# Altium schematic sheet DS1302.SchDoc
size A0
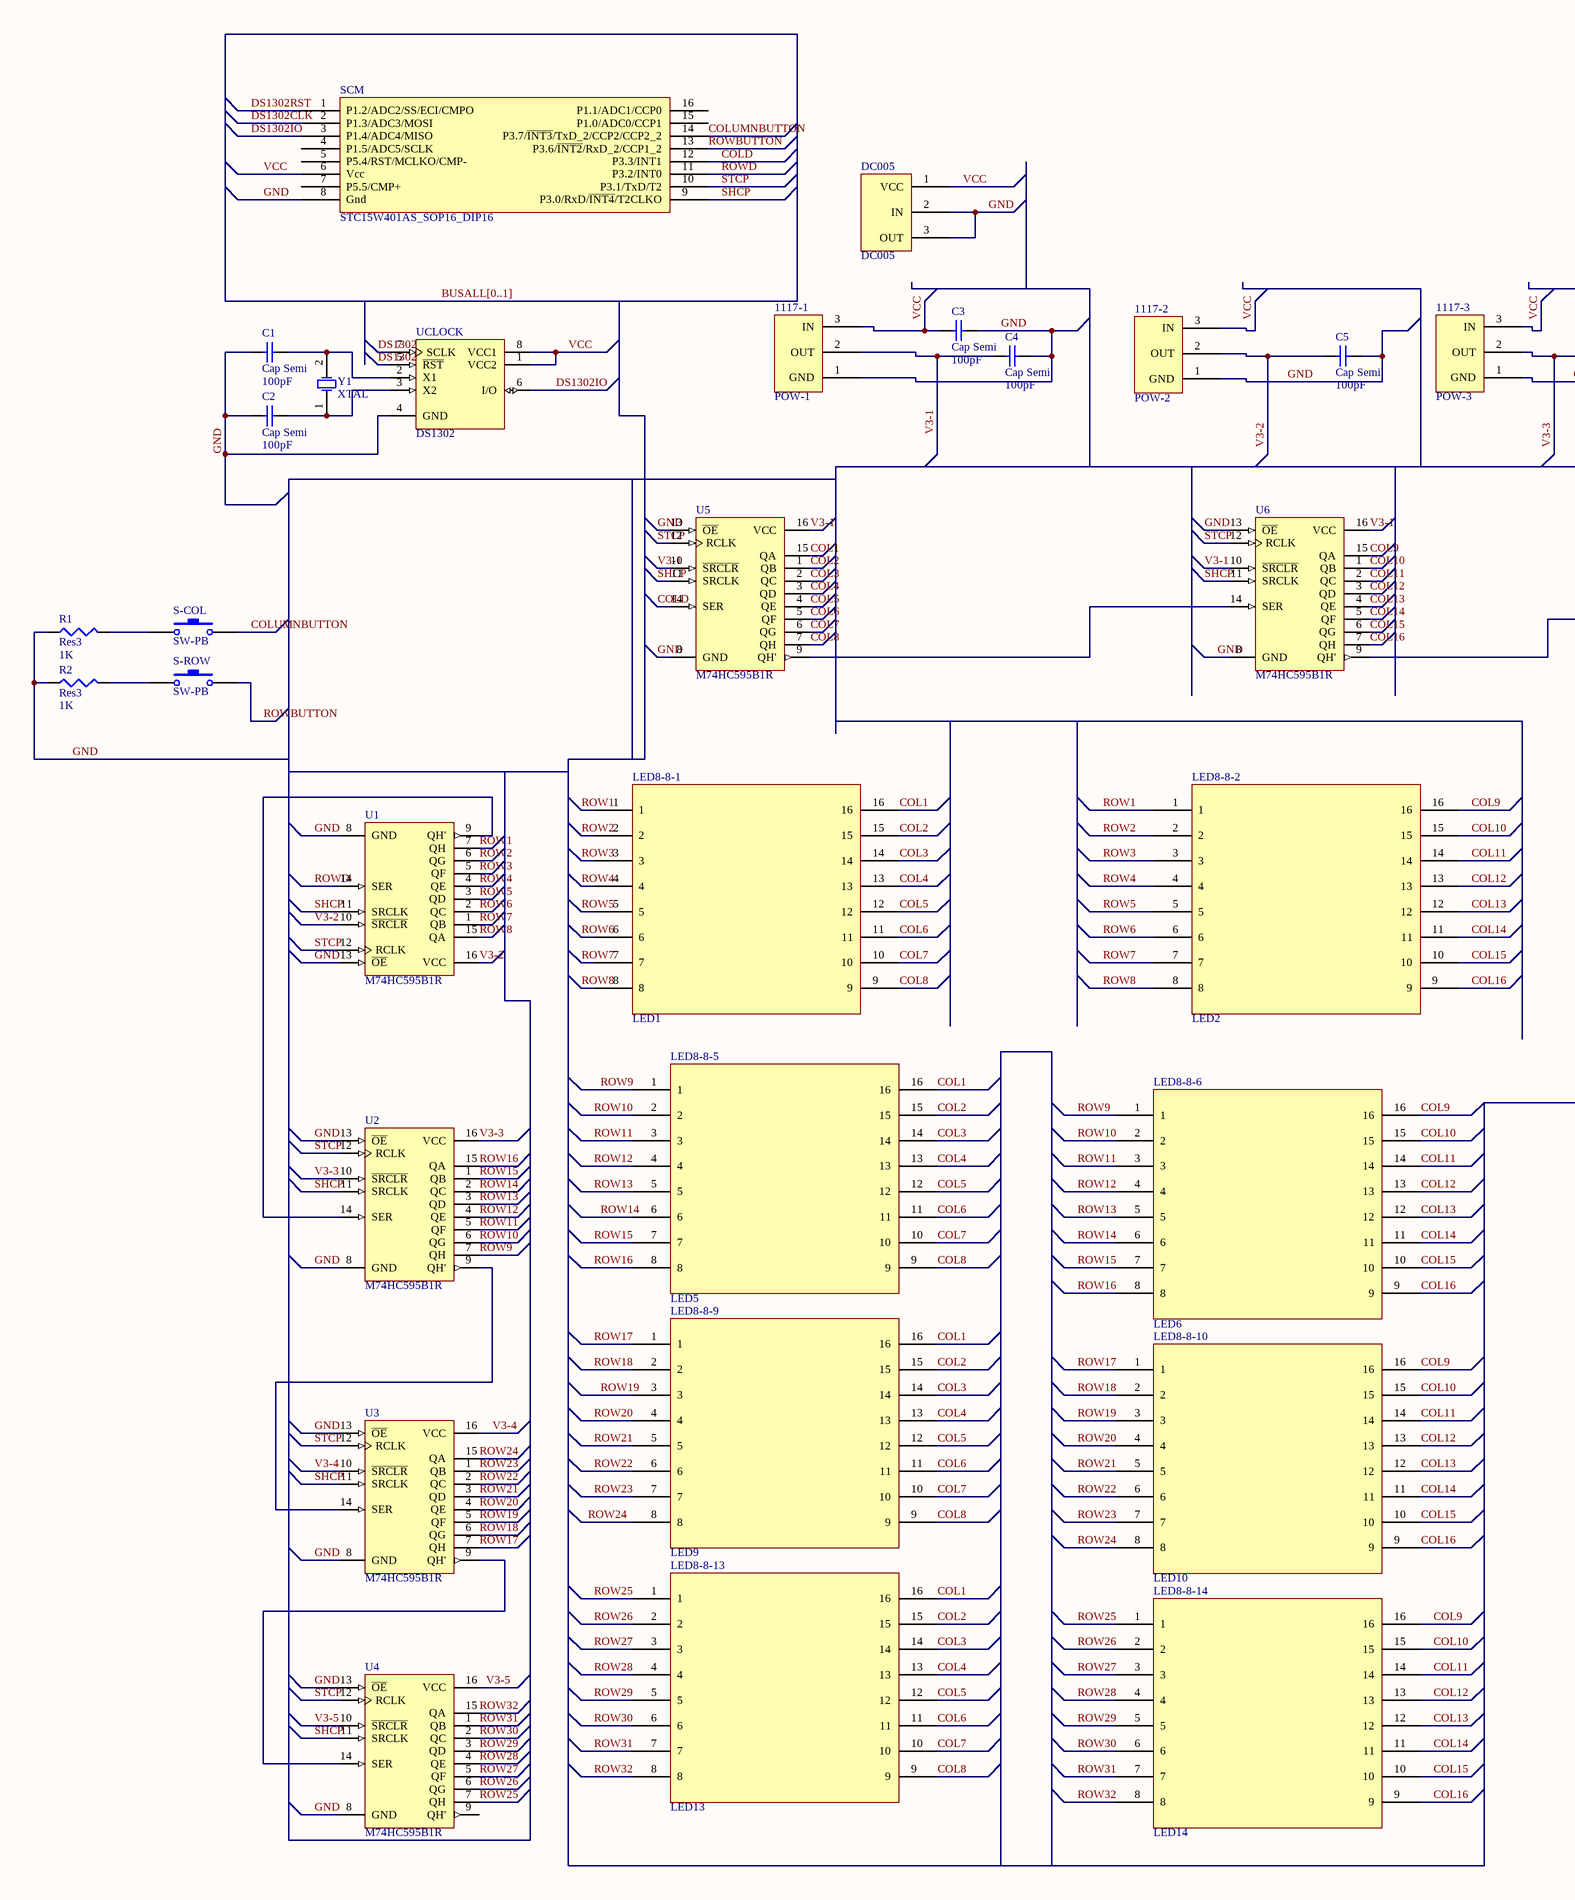
[diagram p0: DS1302.SchDoc, left]
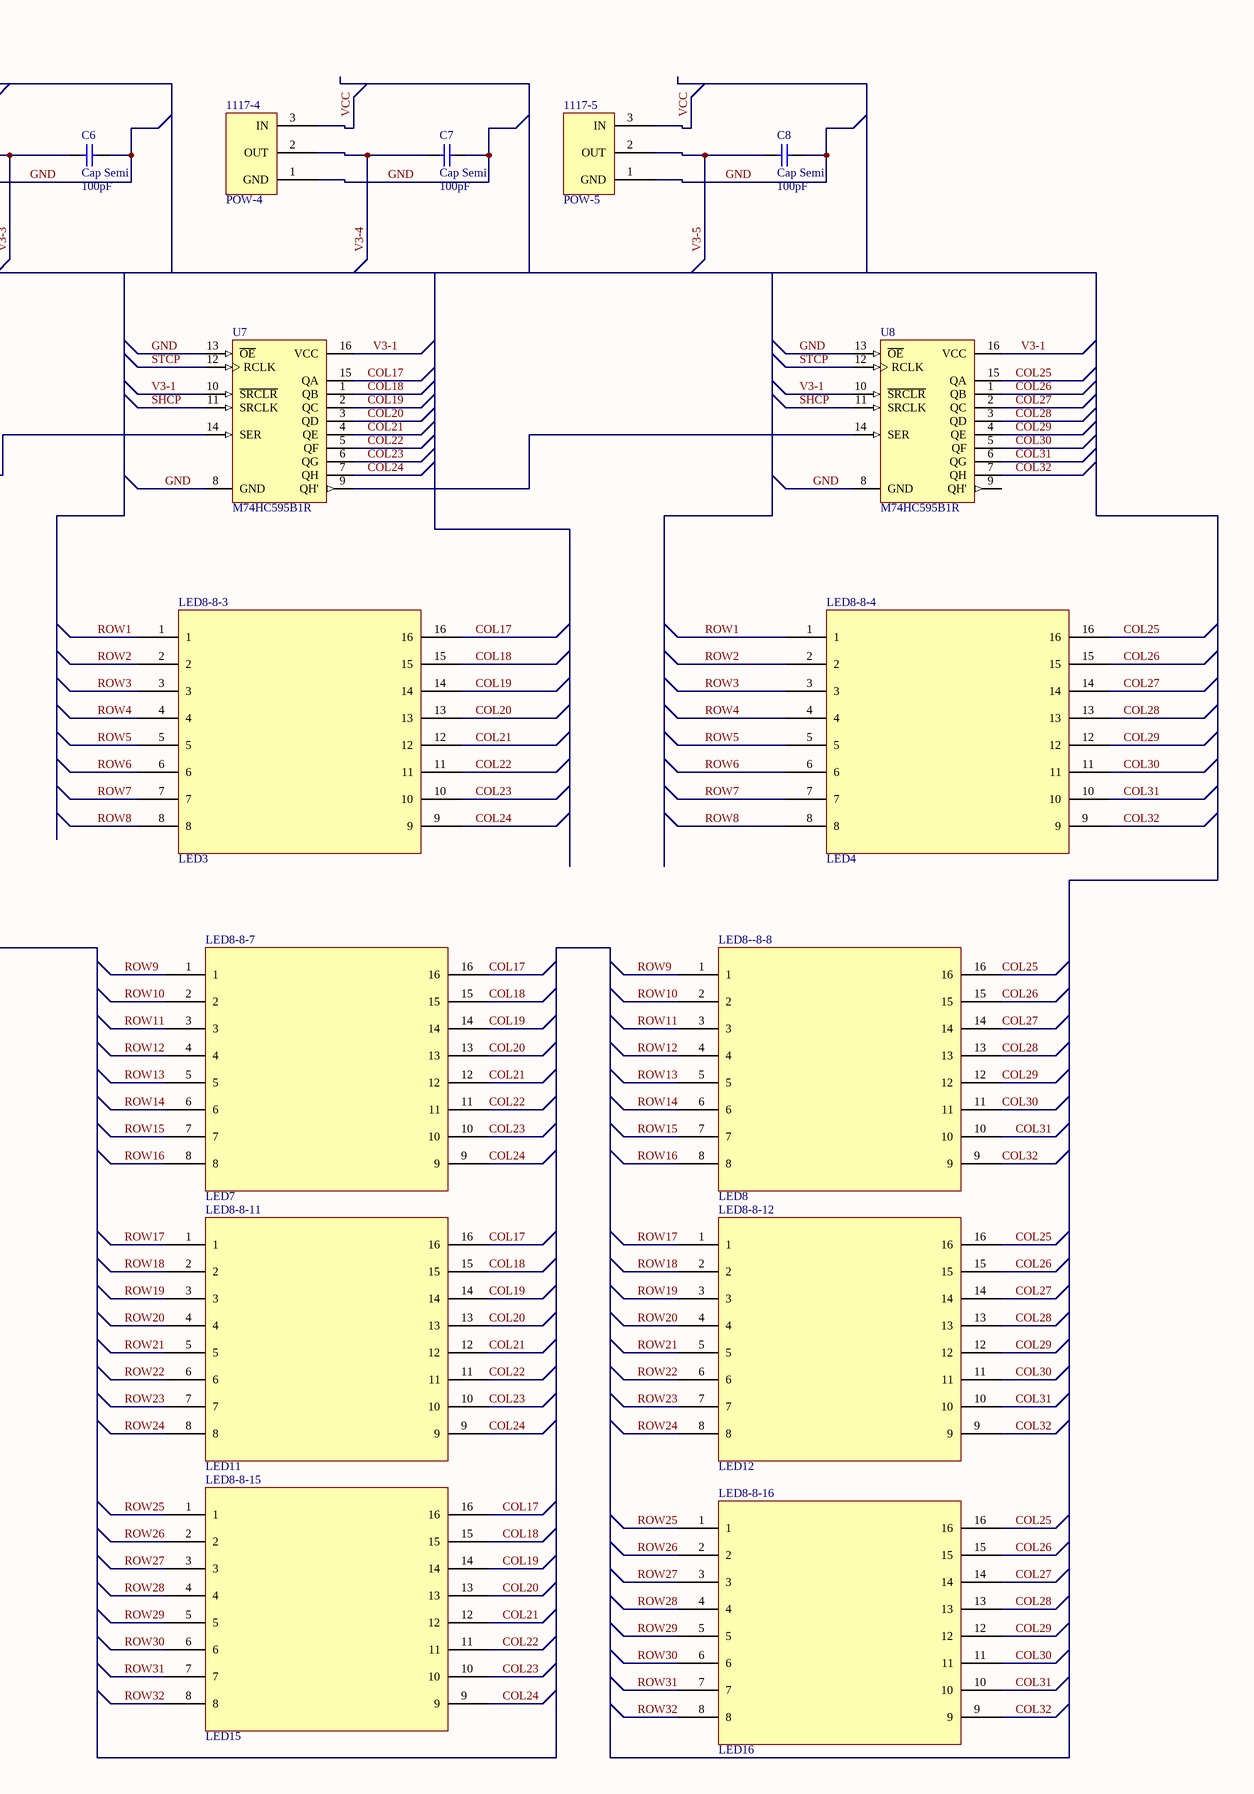
[diagram p1: DS1302.SchDoc, right]

## Parts
1117-1  POW-1  [SOT223-4L]
1117-2  POW-2  [SOT223-4L]
1117-3  POW-3  [SOT223-4L]
1117-4  POW-4  [SOT223-4L]
1117-5  POW-5  [SOT223-4L]
C1  Cap Semi  value 100pF  [2012[0805]]
C2  Cap Semi  value 100pF  [2012[0805]]
C3  Cap Semi  value 100pF  [2012[0805]]
C4  Cap Semi  value 100pF  [2012[0805]]
C5  Cap Semi  value 100pF  [2012[0805]]
C6  Cap Semi  value 100pF  [2012[0805]]
C7  Cap Semi  value 100pF  [2012[0805]]
C8  Cap Semi  value 100pF  [2012[0805]]
DC005  DC005  [DC005]
LED8-8-1  LED1  [LED8-8New]
LED8-8-2  LED2  [LED8-8New]
LED8-8-3  LED3  [LED8-8New]
LED8-8-4  LED4  [LED8-8New]
LED8-8-5  LED5  [LED8-8New]
LED8-8-6  LED6  [LED8-8New]
LED8-8-7  LED7  [LED8-8New]
LED8-8-9  LED9  [LED8-8New]
LED8-8-10  LED10  [LED8-8New]
LED8-8-11  LED11  [LED8-8New]
LED8-8-12  LED12  [LED8-8New]
LED8-8-13  LED13  [LED8-8New]
LED8-8-14  LED14  [LED8-8New]
LED8-8-15  LED15  [LED8-8New]
LED8-8-16  LED16  [LED8-8New]
LED8--8-8  LED8  [LED8-8New]
R1  Res3  value 1K  [2012[0805]]
R2  Res3  value 1K  [2012[0805]]
S-COL  SW-PB  [6332[2512]]
S-ROW  SW-PB  [6332[2512]]
SCM  STC15W401AS_SOP16_DIP16  [DIP-16]
U1  M74HC595B1R  [DIP-16]
U2  M74HC595B1R  [DIP-16]
U3  M74HC595B1R  [DIP-16]
U4  M74HC595B1R  [DIP-16]
U5  M74HC595B1R  [DIP-16]
U6  M74HC595B1R  [DIP-16]
U7  M74HC595B1R  [DIP-16]
U8  M74HC595B1R  [DIP-16]
UCLOCK  DS1302  [DIP8]
Y1  XTAL  [R38]

## Nets
COL1: LED8-8-1.16 LED8-8-5.16 LED8-8-9.16 LED8-8-13.16 U5.15(QA)
COL2: LED8-8-1.15 LED8-8-5.15 LED8-8-9.15 LED8-8-13.15 U5.1(QB)
COL3: LED8-8-1.14 LED8-8-5.14 LED8-8-9.14 LED8-8-13.14 U5.2(QC)
COL4: LED8-8-1.13 LED8-8-5.13 LED8-8-9.13 LED8-8-13.13 U5.3(QD)
COL5: LED8-8-1.12 LED8-8-5.12 LED8-8-9.12 LED8-8-13.12 U5.4(QE)
COL6: LED8-8-1.11 LED8-8-5.11 LED8-8-9.11 LED8-8-13.11 U5.5(QF)
COL7: LED8-8-1.10 LED8-8-5.10 LED8-8-9.10 LED8-8-13.10 U5.6(QG)
COL8: LED8-8-1.9 LED8-8-5.9 LED8-8-9.9 LED8-8-13.9 U5.7(QH)
COL9: LED8-8-2.16 LED8-8-6.16 LED8-8-10.16 LED8-8-14.16 U6.15(QA)
COL10: LED8-8-2.15 LED8-8-6.15 LED8-8-10.15 LED8-8-14.15 U6.1(QB)
COL11: LED8-8-2.14 LED8-8-6.14 LED8-8-10.14 LED8-8-14.14 U6.2(QC)
COL12: LED8-8-2.13 LED8-8-6.13 LED8-8-10.13 LED8-8-14.13 U6.3(QD)
COL13: LED8-8-2.12 LED8-8-6.12 LED8-8-10.12 LED8-8-14.12 U6.4(QE)
COL14: LED8-8-2.11 LED8-8-6.11 LED8-8-10.11 LED8-8-14.11 U6.5(QF)
COL15: LED8-8-2.10 LED8-8-6.10 LED8-8-10.10 LED8-8-14.10 U6.6(QG)
COL16: LED8-8-2.9 LED8-8-6.9 LED8-8-10.9 LED8-8-14.9 U6.7(QH)
COL17: LED8-8-3.16 LED8-8-7.16 LED8-8-11.16 LED8-8-15.16 U7.15(QA)
COL18: LED8-8-3.15 LED8-8-7.15 LED8-8-11.15 LED8-8-15.15 U7.1(QB)
COL19: LED8-8-3.14 LED8-8-7.14 LED8-8-11.14 LED8-8-15.14 U7.2(QC)
COL20: LED8-8-3.13 LED8-8-7.13 LED8-8-11.13 LED8-8-15.13 U7.3(QD)
COL21: LED8-8-3.12 LED8-8-7.12 LED8-8-11.12 LED8-8-15.12 U7.4(QE)
COL22: LED8-8-3.11 LED8-8-7.11 LED8-8-11.11 LED8-8-15.11 U7.5(QF)
COL23: LED8-8-3.10 LED8-8-7.10 LED8-8-11.10 LED8-8-15.10 U7.6(QG)
COL24: LED8-8-3.9 LED8-8-7.9 LED8-8-11.9 LED8-8-15.9 U7.7(QH)
COL25: LED8-8-4.16 LED8-8-12.16 LED8-8-16.16 LED8--8-8.16 U8.15(QA)
COL26: LED8-8-4.15 LED8-8-12.15 LED8-8-16.15 LED8--8-8.15 U8.1(QB)
COL27: LED8-8-4.14 LED8-8-12.14 LED8-8-16.14 LED8--8-8.14 U8.2(QC)
COL28: LED8-8-4.13 LED8-8-12.13 LED8-8-16.13 LED8--8-8.13 U8.3(QD)
COL29: LED8-8-4.12 LED8-8-12.12 LED8-8-16.12 LED8--8-8.12 U8.4(QE)
COL30: LED8-8-4.11 LED8-8-12.11 LED8-8-16.11 LED8--8-8.11 U8.5(QF)
COL31: LED8-8-4.10 LED8-8-12.10 LED8-8-16.10 LED8--8-8.10 U8.6(QG)
COL32: LED8-8-4.9 LED8-8-12.9 LED8-8-16.9 LED8--8-8.9 U8.7(QH)
COLD: SCM.12(P3.3/INT1) U5.14(SER)
COLUMNBUTTON: S-COL.2 SCM.14(P3.7/~{INT3}/TxD_2/CCP2/CCP2_2)
DS1302CLK: SCM.2(P1.3/ADC3/MOSI) UCLOCK.7(SCLK)
DS1302IO: SCM.3(P1.4/ADC4/MISO) UCLOCK.6(I/O)
DS1302RST: SCM.1(P1.2/ADC2/SS/ECI/CMPO) UCLOCK.5(~{RST})
GND: 1117-1.1(GND) 1117-2.1(GND) 1117-3.1(GND) 1117-4.1(GND) 1117-5.1(GND) C1.1 C2.1 C3.2 C4.2 C5.2 C6.2 C7.2 C8.2 DC005.2(IN) DC005.3(OUT) R1.1 R2.1 SCM.8(Gnd) U1.8(GND) U1.13(~{OE}) U2.8(GND) U2.13(~{OE}) U3.8(GND) U3.13(~{OE}) U4.8(GND) U4.13(~{OE}) U5.8(GND) U5.13(~{OE}) U6.8(GND) U6.13(~{OE}) U7.8(GND) U7.13(~{OE}) U8.8(GND) U8.13(~{OE}) UCLOCK.4(GND)
ROW1: LED8-8-1.1 LED8-8-2.1 LED8-8-3.1 LED8-8-4.1 U1.7(QH)
ROW2: LED8-8-1.2 LED8-8-2.2 LED8-8-3.2 LED8-8-4.2 U1.6(QG)
ROW3: LED8-8-1.3 LED8-8-2.3 LED8-8-3.3 LED8-8-4.3 U1.5(QF)
ROW4: LED8-8-1.4 LED8-8-2.4 LED8-8-3.4 LED8-8-4.4 U1.4(QE)
ROW5: LED8-8-1.5 LED8-8-2.5 LED8-8-3.5 LED8-8-4.5 U1.3(QD)
ROW6: LED8-8-1.6 LED8-8-2.6 LED8-8-3.6 LED8-8-4.6 U1.2(QC)
ROW7: LED8-8-1.7 LED8-8-2.7 LED8-8-3.7 LED8-8-4.7 U1.1(QB)
ROW8: LED8-8-1.8 LED8-8-2.8 LED8-8-3.8 LED8-8-4.8 U1.15(QA)
ROW9: LED8-8-5.1 LED8-8-6.1 LED8-8-7.1 LED8--8-8.1 U2.7(QH)
ROW10: LED8-8-5.2 LED8-8-6.2 LED8-8-7.2 LED8--8-8.2 U2.6(QG)
ROW11: LED8-8-5.3 LED8-8-6.3 LED8-8-7.3 LED8--8-8.3 U2.5(QF)
ROW12: LED8-8-5.4 LED8-8-6.4 LED8-8-7.4 LED8--8-8.4 U2.4(QE)
ROW13: LED8-8-5.5 LED8-8-6.5 LED8-8-7.5 LED8--8-8.5 U2.3(QD)
ROW14: LED8-8-5.6 LED8-8-6.6 LED8-8-7.6 LED8--8-8.6 U2.2(QC)
ROW15: LED8-8-5.7 LED8-8-6.7 LED8-8-7.7 LED8--8-8.7 U2.1(QB)
ROW16: LED8-8-5.8 LED8-8-6.8 LED8-8-7.8 LED8--8-8.8 U2.15(QA)
ROW17: LED8-8-9.1 LED8-8-10.1 LED8-8-11.1 LED8-8-12.1 U3.7(QH)
ROW18: LED8-8-9.2 LED8-8-10.2 LED8-8-11.2 LED8-8-12.2 U3.6(QG)
ROW19: LED8-8-9.3 LED8-8-10.3 LED8-8-11.3 LED8-8-12.3 U3.5(QF)
ROW20: LED8-8-9.4 LED8-8-10.4 LED8-8-11.4 LED8-8-12.4 U3.4(QE)
ROW21: LED8-8-9.5 LED8-8-10.5 LED8-8-11.5 LED8-8-12.5 U3.3(QD)
ROW22: LED8-8-9.6 LED8-8-10.6 LED8-8-11.6 LED8-8-12.6 U3.2(QC)
ROW23: LED8-8-9.7 LED8-8-10.7 LED8-8-11.7 LED8-8-12.7 U3.1(QB)
ROW24: LED8-8-9.8 LED8-8-10.8 LED8-8-11.8 LED8-8-12.8 U3.15(QA)
ROW25: LED8-8-13.1 LED8-8-14.1 LED8-8-15.1 LED8-8-16.1 U4.7(QH)
ROW26: LED8-8-13.2 LED8-8-14.2 LED8-8-15.2 LED8-8-16.2 U4.6(QG)
ROW27: LED8-8-13.3 LED8-8-14.3 LED8-8-15.3 LED8-8-16.3 U4.5(QF)
ROW28: LED8-8-13.4 LED8-8-14.4 LED8-8-15.4 LED8-8-16.4 U4.4(QE)
ROW29: LED8-8-13.5 LED8-8-14.5 LED8-8-15.5 LED8-8-16.5 U4.3(QD)
ROW30: LED8-8-13.6 LED8-8-14.6 LED8-8-15.6 LED8-8-16.6 U4.2(QC)
ROW31: LED8-8-13.7 LED8-8-14.7 LED8-8-15.7 LED8-8-16.7 U4.1(QB)
ROW32: LED8-8-13.8 LED8-8-14.8 LED8-8-15.8 LED8-8-16.8 U4.15(QA)
ROWBUTTON: S-ROW.2 SCM.13(P3.6/~{INT2}/RxD_2/CCP1_2)
ROWD: SCM.11(P3.2/INT0) U1.14(SER)
SHCP: SCM.9(P3.0/RxD/~{INT4}/T2CLKO) U1.11(SRCLK) U2.11(SRCLK) U3.11(SRCLK) U4.11(SRCLK) U5.11(SRCLK) U6.11(SRCLK) U7.11(SRCLK) U8.11(SRCLK)
STCP: SCM.10(P3.1/TxD/T2) U1.12(RCLK) U2.12(RCLK) U3.12(RCLK) U4.12(RCLK) U5.12(RCLK) U6.12(RCLK) U7.12(RCLK) U8.12(RCLK)
V3-1: 1117-1.2(OUT) C4.1 U5.10(~{SRCLR}) U5.16(VCC) U6.10(~{SRCLR}) U6.16(VCC) U7.10(~{SRCLR}) U7.16(VCC) U8.10(~{SRCLR}) U8.16(VCC)
V3-2: 1117-2.2(OUT) C5.1 U1.10(~{SRCLR}) U1.16(VCC)
V3-3: 1117-3.2(OUT) C6.1 U2.10(~{SRCLR}) U2.16(VCC)
V3-4: 1117-4.2(OUT) C7.1 U3.10(~{SRCLR}) U3.16(VCC)
V3-5: 1117-5.2(OUT) C8.1 U4.10(~{SRCLR}) U4.16(VCC)
VCC: 1117-1.3(IN) 1117-2.3(IN) 1117-3.3(IN) 1117-4.3(IN) 1117-5.3(IN) C3.1 DC005.1(VCC) SCM.6(Vcc) UCLOCK.1(VCC2) UCLOCK.8(VCC1)
NetC1_2: C1.2 UCLOCK.2(X1) Y1.2(OSC2)
NetC2_2: C2.2 UCLOCK.3(X2) Y1.1(OSC1)
NetR1_2: R1.2 S-COL.1
NetR2_2: R2.2 S-ROW.1
NetU1_9: U1.9(QH') U2.14(SER)
NetU2_9: U2.9(QH') U3.14(SER)
NetU3_9: U3.9(QH') U4.14(SER)
NetU5_9: U5.9(QH') U6.14(SER)
NetU6_9: U6.9(QH') U7.14(SER)
NetU7_9: U7.9(QH') U8.14(SER)

Not connected (* = marked no-connect by the designer): SCM 4(P1.5/ADC5/SCLK) 5(P5.4/RST/MCLKO/CMP-) 7(P5.5/CMP+) 15(P1.0/ADC0/CCP1) 16(P1.1/ADC1/CCP0); U4 9(QH'); U8 9(QH')

## Buses and harness runs
bus BUSALL[0..1]

## Library data of the parts
1117-1-1117-5 = 1117
C1-C8 = Cap Semi: Capacitor (Semiconductor SIM Model); Published: 8-Jun-2000; LatestRevisionDate: 17-Jul-2002; LatestRevisionNote: Re-released for DXP Platform.; PackageReference: C1206; Publisher: Altium Limited
LED8-8-1-LED8-8-7 LED8-8-9-LED8-8-16 LED8--8-8 = LED8-8
R1 R2 = Res3: Resistor; Published: 8-Jun-2000; LatestRevisionDate: 04-Mar-2005; LatestRevisionNote: PCB Footprint replaced.; PackageReference: J1-0603; Publisher: Altium Limited
S-COL S-ROW = SW-PB: Switch; Published: 24-Mar-1999; LatestRevisionDate: 17-Jul-2002; LatestRevisionNote: Re-released for DXP Platform.; PackageReference: SPST-2; Publisher: Altium Limited
U1-U8 = M74HC595B1R: 8 Bit Shift Register with Output Latches (3 STATE); Published: 8-Jun-2000; LatestRevisionDate: 06-Jun-2005; LatestRevisionNote: Stylized 3D Model Added.; DatasheetVersion: Apr-1993; PackageVersion: Apr-1996; PackageReference: DIP16; Publisher: Altium Limited; PackageDescription: DIP; 16 Leads; Row Spacing 7.62 mm; Pitch 2.54 mm; ComponentLink1Description: Manufacturer Link; ComponentLink1URL: http://www.st.com/; ComponentLink2Description: Datasheet; ComponentLink2URL: http://www.st.com/stonline/products/literature/ds/1989/m74hc595.pdf
UCLOCK = DS1302: Trickle Charge Timekeeping Chip; Published: 13-Oct-2000; LatestRevisionDate: 06-Jun-2005; LatestRevisionNote: Stylized 3D Model Added.; DatasheetVersion: 2-Jul-1999; PackageVersion: 1999; PackageReference: DIP8; Publisher: Altium Limited; PackageDescription: DIP; 8 Leads; Row Spacing 7.62 mm; Pitch 2.54 mm; ComponentLink1Description: Manufacturer Link; ComponentLink1URL: http://www.maxim-ic.com/; ComponentLink2Description: Datasheet; ComponentLink2URL: http://pdfserv.maxim-ic.com/en/ds/DS1302.pdf
Y1 = XTAL: Crystal Oscillator; Published: 8-Jun-2000; LatestRevisionDate: 17-Jul-2002; LatestRevisionNote: Re-released for DXP Platform.; PackageReference: R38; Publisher: Altium Limited